# EAGLE design zero_board (EAGLE 9.6.2)
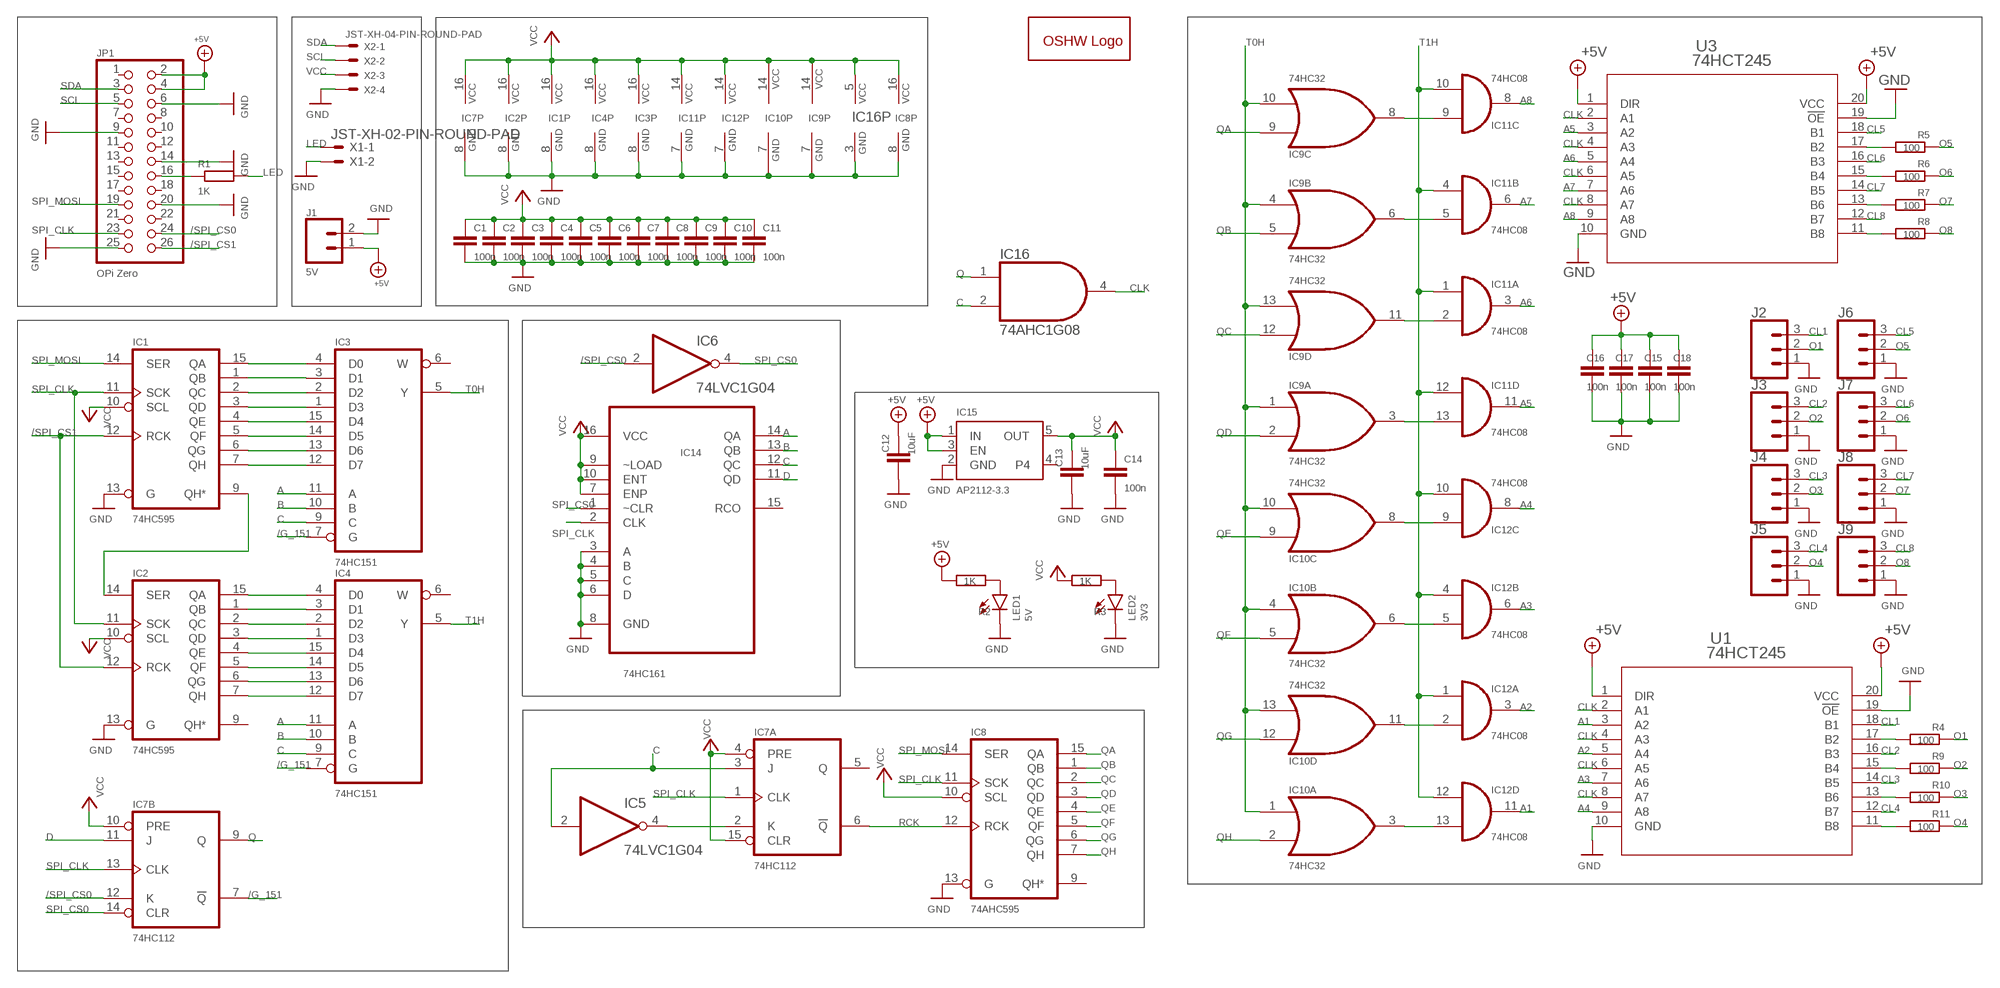
[diagram p0: schematic, sheet 1]

## Parts
C1  100n  C-EUC0603  [C0603]
C2  100n  C-EUC0603  [C0603]
C3  100n  C-EUC0603  [C0603]
C4  100n  C-EUC0603  [C0603]
C5  100n  C-EUC0603  [C0603]
C6  100n  C-EUC0603  [C0603]
C7  100n  C-EUC0603  [C0603]
C8  100n  C-EUC0603  [C0603]
C9  100n  C-EUC0603  [C0603]
C10  100n  C-EUC0603  [C0603]
C11  100n  C-EUC0603  [C0603]
C12  10uF  C-EUC0805  [C0805]
C13  10uF  C-EUC0805  [C0805]
C14  100n  C-EUC0603  [C0603]
C15  100n  C-EUC0603  [C0603]
C16  100n  C-EUC0603  [C0603]
C17  100n  C-EUC0603  [C0603]
C18  100n  C-EUC0603  [C0603]
GOLD_ORB_SM1  OSHWLOGOLOGO5MM  [OSHW_5MM]
IC1  74HC595  74HC595D  [SO16]
IC2  74HC595  74HC595D  [SO16]
IC3  74HC151  74HC151D  [SO16]
IC4  74HC151  74HC151D  [SO16]
IC5  74LVC1G04  74LVC1G04DCK  [SC70-5]
IC6  74LVC1G04  74LVC1G04DCK  [SC70-5]
IC7  74HC112  74HC112D  [SO16]
IC8  74AHC595  74HC595D  [SO16]
IC9  74HC32  74LS32D  [SO14]
IC10  74HC32  74LS32D  [SO14]
IC11  74HC08  74HC08D  [SO14]
IC12  74HC08  74HC08D  [SO14]
IC14  74HC161  SN74HC161DR  [SOIC127P600X175-16N]
IC15  AP2112-3.3  VREG_SOT23-5  [SOT23-5]
IC16  74AHC1G08  74AHC1G08DCK  [SC70-5]
J1  5V  CONN_023.5MM  [SCREWTERMINAL-3.5MM-2]
J2  CONN_03SCREW-NS  [SCREWTERMINAL-3.5MM-3-NS]
J3  CONN_03SCREW-NS  [SCREWTERMINAL-3.5MM-3-NS]
J4  CONN_03SCREW-NS  [SCREWTERMINAL-3.5MM-3-NS]
J5  CONN_03SCREW-NS  [SCREWTERMINAL-3.5MM-3-NS]
J6  CONN_03SCREW-NS  [SCREWTERMINAL-3.5MM-3-NS]
J7  CONN_03SCREW-NS  [SCREWTERMINAL-3.5MM-3-NS]
J8  CONN_03SCREW-NS  [SCREWTERMINAL-3.5MM-3-NS]
J9  CONN_03SCREW-NS  [SCREWTERMINAL-3.5MM-3-NS]
JP1  OPi Zero  PINHD-2X13  [2X13]
LED1  5V  LEDCHIP-LED0603  [CHIP-LED0603]
LED2  3V3  LEDCHIP-LED0603  [CHIP-LED0603]
R1  1K  R-EU_R0603  [R0603]
R2  1K  R-EU_R0603  [R0603]
R3  1K  R-EU_R0603  [R0603]
R4  100  R-EU_R0603  [R0603]
R5  100  R-EU_R0603  [R0603]
R6  100  R-EU_R0603  [R0603]
R7  100  R-EU_R0603  [R0603]
R8  100  R-EU_R0603  [R0603]
R9  100  R-EU_R0603  [R0603]
R10  100  R-EU_R0603  [R0603]
R11  100  R-EU_R0603  [R0603]
U1  74HCT245  SN74HCT245PWR  [PW20]
U3  74HCT245  SN74HCT245PWR  [PW20]
X1  JST-XH-02-PIN-ROUND-PAD  [JST-XH-02-PACKAGE-ROUND-PAD]
X2  JST-XH-04-PIN-ROUND-PAD  [JST-XH-04-PACKAGE-ROUND-PAD]

## Nets
+5V: C12.1 C15.1 C16.1 C17.1 C18.1 IC15.1(IN) IC15.3(EN) J1.1 JP1.2 JP1.4 R2.1 U1.1(DIR) U1.20(VCC) U3.1(DIR) U3.20(VCC)
/G_151: IC3.7(G) IC4.7(G) IC7.7(B:!Q)
/SPI_CS0: IC6.2(I) IC7.12(B:K) JP1.24
/SPI_CS1: IC1.12(RCK) IC2.12(RCK) JP1.26
A: IC3.11(A) IC4.11(A) IC14.14(QA)
A1: IC12.11(D:O) U1.3(A2)
A2: IC12.3(A:O) U1.5(A4)
A3: IC12.6(B:O) U1.7(A6)
A4: IC12.8(C:O) U1.9(A8)
A5: IC11.11(D:O) U3.3(A2)
A6: IC11.3(A:O) U3.5(A4)
A7: IC11.6(B:O) U3.7(A6)
A8: IC11.8(C:O) U3.9(A8)
B: IC3.10(B) IC4.10(B) IC14.13(QB)
C: IC3.9(C) IC4.9(C) IC5.2(I) IC7.3(A:J) IC14.12(QC) IC16.2(I1)
CL1: J2.3 U1.18(B1)
CL2: J3.3 U1.16(B3)
CL3: J4.3 U1.14(B5)
CL4: J5.3 U1.12(B7)
CL5: J6.3 U3.18(B1)
CL6: J7.3 U3.16(B3)
CL7: J8.3 U3.14(B5)
CL8: J9.3 U3.12(B7)
CLK: IC16.4(O) U1.2(A1) U1.4(A3) U1.6(A5) U1.8(A7) U3.2(A1) U3.4(A3) U3.6(A5) U3.8(A7)
D: IC7.11(B:J) IC14.11(QD)
GND: C1.2 C2.2 C3.2 C4.2 C5.2 C6.2 C7.2 C8.2 C9.2 C10.2 C11.2 C12.2 C13.2 C14.2 C15.2 C16.2 C17.2 C18.2 IC1.8(GND) IC1.13(G) IC2.8(GND) IC2.13(G) IC3.8(GND) IC4.8(GND) IC7.8(P:GND) IC8.8(GND) IC8.13(G) IC9.7(P:GND) IC10.7(P:GND) IC11.7(P:GND) IC12.7(P:GND) IC14.3(A) IC14.4(B) IC14.5(C) IC14.6(D) IC14.8(GND) IC15.2(GND) IC16.3(GND) J1.2 J2.1 J3.1 J4.1 J5.1 J6.1 J7.1 J8.1 J9.1 JP1.6 JP1.9 JP1.14 JP1.20 JP1.25 LED1.C LED2.C U1.10(GND) U1.19(!OE) U3.10(GND) U3.19(!OE) X1.2 X2.4
LED: R1.2 X1.1
N$1: IC10.11(D:O) IC12.2(A:I1)
N$2: IC10.6(B:O) IC12.5(B:I1)
N$3: IC10.8(C:O) IC12.9(C:I0)
N$4: IC10.3(A:O) IC12.13(D:I1)
N$5: IC9.8(C:O) IC11.9(C:I0)
N$6: IC9.6(B:O) IC11.5(B:I1)
N$7: IC9.11(D:O) IC11.2(A:I1)
N$8: JP1.16 R1.1
N$9: R11.1 U1.11(B8)
N$10: R8.1 U3.11(B8)
N$11: IC1.15(QA) IC3.4(D0)
N$12: IC1.1(QB) IC3.3(D1)
N$13: IC1.2(QC) IC3.2(D2)
N$14: IC1.3(QD) IC3.1(D3)
N$15: IC5.4(O) IC7.2(A:K)
N$16: IC9.3(A:O) IC11.13(D:I1)
N$17: R7.1 U3.13(B6)
N$19: IC2.15(QA) IC4.4(D0)
N$20: R10.1 U1.13(B6)
N$21: IC1.4(QE) IC3.15(D4)
N$22: IC1.5(QF) IC3.14(D5)
N$23: IC1.6(QG) IC3.13(D6)
N$24: IC1.7(QH) IC3.12(D7)
N$25: IC2.1(QB) IC4.3(D1)
N$26: R6.1 U3.15(B4)
N$27: IC2.2(QC) IC4.2(D2)
N$28: IC2.3(QD) IC4.1(D3)
N$29: IC2.4(QE) IC4.15(D4)
N$30: IC2.5(QF) IC4.14(D5)
N$31: IC2.6(QG) IC4.13(D6)
N$32: IC2.7(QH) IC4.12(D7)
N$34: R5.1 U3.17(B2)
N$35: LED1.A R2.2
N$36: LED2.A R3.2
N$37: R9.1 U1.15(B4)
N$39: R4.1 U1.17(B2)
N$44: IC1.9(QH*) IC2.14(SER)
O1: J2.2 R4.2
O2: J3.2 R9.2
O3: J4.2 R10.2
O4: J5.2 R11.2
O5: J6.2 R5.2
O6: J7.2 R6.2
O7: J8.2 R7.2
O8: J9.2 R8.2
Q: IC7.9(B:Q) IC16.1(I0)
QA: IC8.15(QA) IC9.9(C:I0)
QB: IC8.1(QB) IC9.5(B:I1)
QC: IC8.2(QC) IC9.12(D:I0)
QD: IC8.3(QD) IC9.2(A:I1)
QE: IC8.4(QE) IC10.9(C:I0)
QF: IC8.5(QF) IC10.5(B:I1)
QG: IC8.6(QG) IC10.12(D:I0)
QH: IC8.7(QH) IC10.2(A:I1)
RCK: IC7.6(A:!Q) IC8.12(RCK)
SCL: JP1.5 X2.2
SDA: JP1.3 X2.1
SPI_CLK: IC1.11(SCK) IC2.11(SCK) IC7.1(A:CLK) IC7.13(B:CLK) IC8.11(SCK) IC14.2(CLK) JP1.23
SPI_CS0: IC6.4(O) IC7.14(B:CLR) IC14.1(~CLR)
SPI_MOSI: IC1.14(SER) IC8.14(SER) JP1.19
T0H: IC3.5(Y) IC9.1(A:I0) IC9.4(B:I0) IC9.10(C:I1) IC9.13(D:I1) IC10.1(A:I0) IC10.4(B:I0) IC10.10(C:I1) IC10.13(D:I1)
T1H: IC4.5(Y) IC11.1(A:I0) IC11.4(B:I0) IC11.10(C:I1) IC11.12(D:I0) IC12.1(A:I0) IC12.4(B:I0) IC12.10(C:I1) IC12.12(D:I0)
VCC: C1.1 C2.1 C3.1 C4.1 C5.1 C6.1 C7.1 C8.1 C9.1 C10.1 C11.1 C13.1 C14.1 IC1.10(SCL) IC1.16(VCC) IC2.10(SCL) IC2.16(VCC) IC3.16(VCC) IC4.16(VCC) IC7.4(A:PRE) IC7.10(B:PRE) IC7.15(A:CLR) IC7.16(P:VCC) IC8.10(SCL) IC8.16(VCC) IC9.14(P:VCC) IC10.14(P:VCC) IC11.14(P:VCC) IC12.14(P:VCC) IC14.7(ENP) IC14.9(~LOAD) IC14.10(ENT) IC14.16(VCC) IC15.5(OUT) IC16.5(VCC) R3.1 X2.3
Unconnected: IC2.9(QH*) IC3.6(W) IC4.6(W) IC7.5(A:Q) IC8.9(QH*) IC14.15(RCO) IC15.4 JP1.1 JP1.7 JP1.8 JP1.10 JP1.11 JP1.12 JP1.13 JP1.15 JP1.17 JP1.18 JP1.21 JP1.22

## Power pins joined to a net without a drawn wire
GND: IC5.3(GND) IC6.3(GND)
VCC: IC5.5(VCC) IC6.5(VCC)

## Library data of the parts
C1-C18 = rcl:C-EU: CAPACITOR, European symbol; SPICEPREFIX: C
GOLD_ORB_SM1 = oshw:OSHWLOGO: The OSHW logo for PCB layout
IC1 IC2 IC8 = 74xx-eu:74*595: 8-bit SHIFT REGISTER, output latch
IC3 IC4 = 74xx-eu:74*151: Data SELECTOR/MULTIPLEXER
IC5 IC6 = 74xx-little-us:74*1G04: INVERTER Gate
IC7 = 74xx-eu:74*112: Dual J-K negative edge triggered FLIP FLOP, preset and clear
IC9 IC10 = 74xx-us:74*32: Quad 2-input OR gate
IC11 IC12 = 74xx-eu:74*08: Quad 2-input AND gate
IC14 = SN74HC161DR:SN74HC161DR: 4-Bit Synchronus Binary Counters; AVAILABILITY: Unavailable; DESCRIPTION: 4-Bit Synchronous Binary Counters 16-SOIC -40 to 85; MF: Texas Instruments; MP: SN74HC161DR; PACKAGE: SOIC-16 Texas Instruments; PRICE: None
IC15 = microbuilder:VREG_SOT23-5: SOT23-5 Fixed Voltage Regulators Part Current Out V Out V In V Dropout θJA (°C/W) TJ (°C) Digikey Part No. ADP121 150mA 3.3V 3.4-5.5V 0.09V @ 150mA -- -- ADP121-AUJZ33R7CT-ND ADP121 150mA 3.0V 3.1-5.5V 0.09V @ 150mA -- -- ADP121-AUJZ30R7CT-ND ADP122 300mA 3.3V 3.4-5.5V 0.085V @ 300mA -- -- ADP122AUJZ-3.3-R7CT-ND ADP1712 300mA 3.3V 3.5-5.5V 0.17V @ 300mA -- -- ADP1712AUJZ-3.3-R7TR-ND AP7311 (Low Cost) 150mA 3.3V 3.5-6V 0.15V @ 150mA -- -- AP7311-33WG-7DICT-ND LD39015M18R 150mA 1.8V 1.9V-5.5V 0.08V @ 100mA -- -- 497-6977-1-ND LP2985A-33DBVR 150mA 3.3V 3.3-16V 0.28V @ 150mA 206 150 296-18479-1-ND MCP1824T-3302E/OT 300mA 3.3V 3.5V-6V 0.2V @ 300mA -- -- MCP1824T-3302E/OTCT-ND MIC5205-2.5YM5 TR 150mA 2.5V 2.7-16V 0.165V @ 150mA -- -- 576-1257-2-ND MIC5205-3.0YM5 TR 150mA 3.0V 3.2V-16V 0.165V @ 150mA -- -- 576-1258-2-ND MIC5205-3.3YM5 TR 150mA 3.3V 3.5V-16V 0.165V @ 150mA -- -- 576-1259-2-ND TPS780330220 150mA 3.3V+2.2V 3.6-5.5V 250mV Max -- -- 296-23332-1-ND TDA3663/N1,135 100mA 3.3V 3.5-45V 0.18V @ 50mA -- -- 568-5343-1-ND Max operating temp can be calculated using θJA, TJ (max junction temperature), and power in watts. Set the "Maximum Ambient Temperature" until it reaches TJ ("Max Junction Temperature"), which is the absolute limit for safe use of the regulator: Heat Sink Temperature Calculator <http://www.daycounter.com/Calculators/Heat-Sink-Temperature-Calculator.phtml> For example, With 12V source into a 3.3V LP2985 and a 30mA load, we are dissipating (12V-3.3V) * 0.03A = 0.261W. With a θJA of 206 °C/W, a TJ of 150°C, and 261mW we can safely use the chip without a heat sink up to 75°C (=147.1°C Junction Temperature).
IC16 = 74xx-little-us:74*1G08: 2-input AND gate
J1 = SparkFun-Connectors:CONN_02: Multi connection point. Often used as Generic Header-pin footprint for 0.1 inch spaced/style header connections On any of the 0.1 inch spaced packages, you can populate with these: Break Away Headers - Straight <https://www.sparkfun.com/products/116> (PRT-00116) Break Away Male Headers - Right Angle <https://www.sparkfun.com/products/553> (PRT-00553) Female Headers <https://www.sparkfun.com/products/115> (PRT-00115) Break Away Headers - Machine Pin <https://www.sparkfun.com/products/117> (PRT-00117) Break Away Female Headers - Swiss Machine Pin <https://www.sparkfun.com/products/743> (PRT-00743) For SCREWTERMINALS and SPRING TERMINALS visit here: Screw Terimnals on SparkFun.com <https://www.sparkfun.com/search/results?term=Screw+Terminals> (5mm/3.5mm/2.54mm spacing) This device is also useful as a general connection point to wire up your design to another part of your project. Our various solder wires solder well into these plated through hole pads. Hook-Up Wire - Assortment (Stranded, 22 AWG) <https://www.sparkfun.com/products/11375> (PRT-11375) Hook-Up Wire - Assortment (Solid Core, 22 AWG) <https://www.sparkfun.com/products/11367> (PRT-11367) View the entire wire category on our website here <https://www.sparkfun.com/categories/141> Special notes: Molex polarized connector foot print use with: PRT-08233 with associated crimp pins and housings. 2.54_SCREWTERM for use with PRT-10571. 3.5mm Screw Terminal footprints for PRT-08084 5mm Screw Terminal footprints for use with PRT-08432; PROD_ID: CONN-08399
J2-J9 = SparkFun-Connectors:CONN_03: Multi connection point. Often used as Generic Header-pin footprint for 0.1 inch spaced/style header connections On any of the 0.1 inch spaced packages, you can populate with these: Break Away Headers - Straight <https://www.sparkfun.com/products/116> (PRT-00116) Break Away Male Headers - Right Angle <https://www.sparkfun.com/products/553> (PRT-00553) Female Headers <https://www.sparkfun.com/products/115> (PRT-00115) Break Away Headers - Machine Pin <https://www.sparkfun.com/products/117> (PRT-00117) Break Away Female Headers - Swiss Machine Pin <https://www.sparkfun.com/products/743> (PRT-00743) Stackable Header - 3 Pin (Female, 0.1") <https://www.sparkfun.com/products/13875> (PRT-13875) For SCREWTERMINALS and SPRING TERMINALS visit here: Screw Terimnals on SparkFun.com <https://www.sparkfun.com/search/results?term=Screw+Terminals> (5mm/3.5mm/2.54mm spacing) This device is also useful as a general connection point to wire up your design to another part of your project. Our various solder wires solder well into these plated through hole pads. Hook-Up Wire - Assortment (Stranded, 22 AWG) <https://www.sparkfun.com/products/11375> (PRT-11375) Hook-Up Wire - Assortment (Solid Core, 22 AWG) <https://www.sparkfun.com/products/11367> (PRT-11367) View the entire wire category on our website here <https://www.sparkfun.com/categories/141> Special notes: Molex polarized connector foot print use with SKU : PRT-08232 with associated crimp pins and housings.
JP1 = pinhead:PINHD-2X13: PIN HEADER
LED1 LED2 = led:LED: LED OSRAM: - CHIPLED LG R971, LG N971, LY N971, LG Q971, LY Q971, LO R971, LY R971 LH N974, LH R974 LS Q976, LO Q976, LY Q976 LO Q996 - Hyper CHIPLED LW Q18S LB Q993, LB Q99A, LB R99A - SideLED LS A670, LO A670, LY A670, LG A670, LP A670 LB A673, LV A673, LT A673, LW A673 LH A674 LY A675 LS A676, LA A676, LO A676, LY A676, LW A676 LS A679, LY A679, LG A679 - Hyper Micro SIDELED® LS Y876, LA Y876, LO Y876, LY Y876 LT Y87S - SmartLED LW L88C, LW L88S LB L89C, LB L89S, LG L890 LS L89K, LO L89K, LY L89K LS L896, LA L896, LO L896, LY L896 - TOPLED LS T670, LO T670, LY T670, LG T670, LP T670 LSG T670, LSP T670, LSY T670, LOP T670, LYG T670 LG T671, LOG T671, LSG T671 LB T673, LV T673, LT T673, LW T673 LH T674 LS T676, LA T676, LO T676, LY T676, LB T676, LH T676, LSB T676, LW T676 LB T67C, LV T67C, LT T67C, LS T67K, LO T67K, LY T67K, LW E67C LS E67B, LA E67B, LO E67B, LY E67B, LB E67C, LV E67C, LT E67C LW T67C LS T679, LY T679, LG T679 LS T770, LO T770, LY T770, LG T770, LP T770 LB T773, LV T773, LT T773, LW T773 LH T774 LS E675, LA E675, LY E675, LS T675 LS T776, LA T776, LO T776, LY T776, LB T776 LHGB T686 LT T68C, LB T68C - Hyper Mini TOPLED® LB M676 - Mini TOPLED Santana® LG M470 LS M47K, LO M47K, LY M47K Source: http://www.osram.convergy.de LUXEON: - LUMILED® LXK2-PW12-R00, LXK2-PW12-S00, LXK2-PW14-U00, LXK2-PW14-V00 LXK2-PM12-R00, LXK2-PM12-S00, LXK2-PM14-U00 LXK2-PE12-Q00, LXK2-PE12-R00, LXK2-PE12-S00, LXK2-PE14-T00, LXK2-PE14-U00 LXK2-PB12-K00, LXK2-PB12-L00, LXK2-PB12-M00, LXK2-PB14-N00, LXK2-PB14-P00, LXK2-PB14-Q00 LXK2-PR12-L00, LXK2-PR12-M00, LXK2-PR14-Q00, LXK2-PR14-R00 LXK2-PD12-Q00, LXK2-PD12-R00, LXK2-PD12-S00 LXK2-PH12-R00, LXK2-PH12-S00 LXK2-PL12-P00, LXK2-PL12-Q00, LXK2-PL12-R00 Source: www.luxeon.com KINGBRIGHT: KA-3528ASYC Source: www.kingbright.com
R1-R11 = rcl:R-EU_: RESISTOR, European symbol
U1 U3 = SN74HCT245PWR:SN74HCT245PWR; DATASHEET_URL: http://www.ti.com/lit/gpn/SN74HCT245; DESCRIPTION: Octal Bus Transceivers With 3-State Outputs; FAMILY_NAME: STANDARD TRANSCEIVER; GENERIC_PART_NUMBER: SN74HCT245; INDUSTRY_STD_PKG_TYPE: TSSOP; MANUFACTURER: Texas Instruments; MANUFACTURER_PART_NUMBER: SN74HCT245PWR; PACKAGE_DESIGNATOR: PW; PIN_COUNT: 20; VENDOR: Texas Instruments
X1 = Rembrandt Electronics - JST XH Connectors v1-0:JST-XH-02-PIN: JST XH Connector 2 Pin Wire to board connector. Pitch: 2,54 mm, (0.100") Number of pins: 2 Created by Rembrandt Electronics www.rembrandtelectronics.com
X2 = Rembrandt Electronics - JST XH Connectors v1-0:JST-XH-04-PIN: JST XH Connector 2 Pin Wire to board connector. Pitch: 2,54 mm, (0.100") Number of pins: 4 Created by Rembrandt Electronics www.rembrandtelectronics.com

## Net classes
0 default: clearance 0.205 mm

## Board
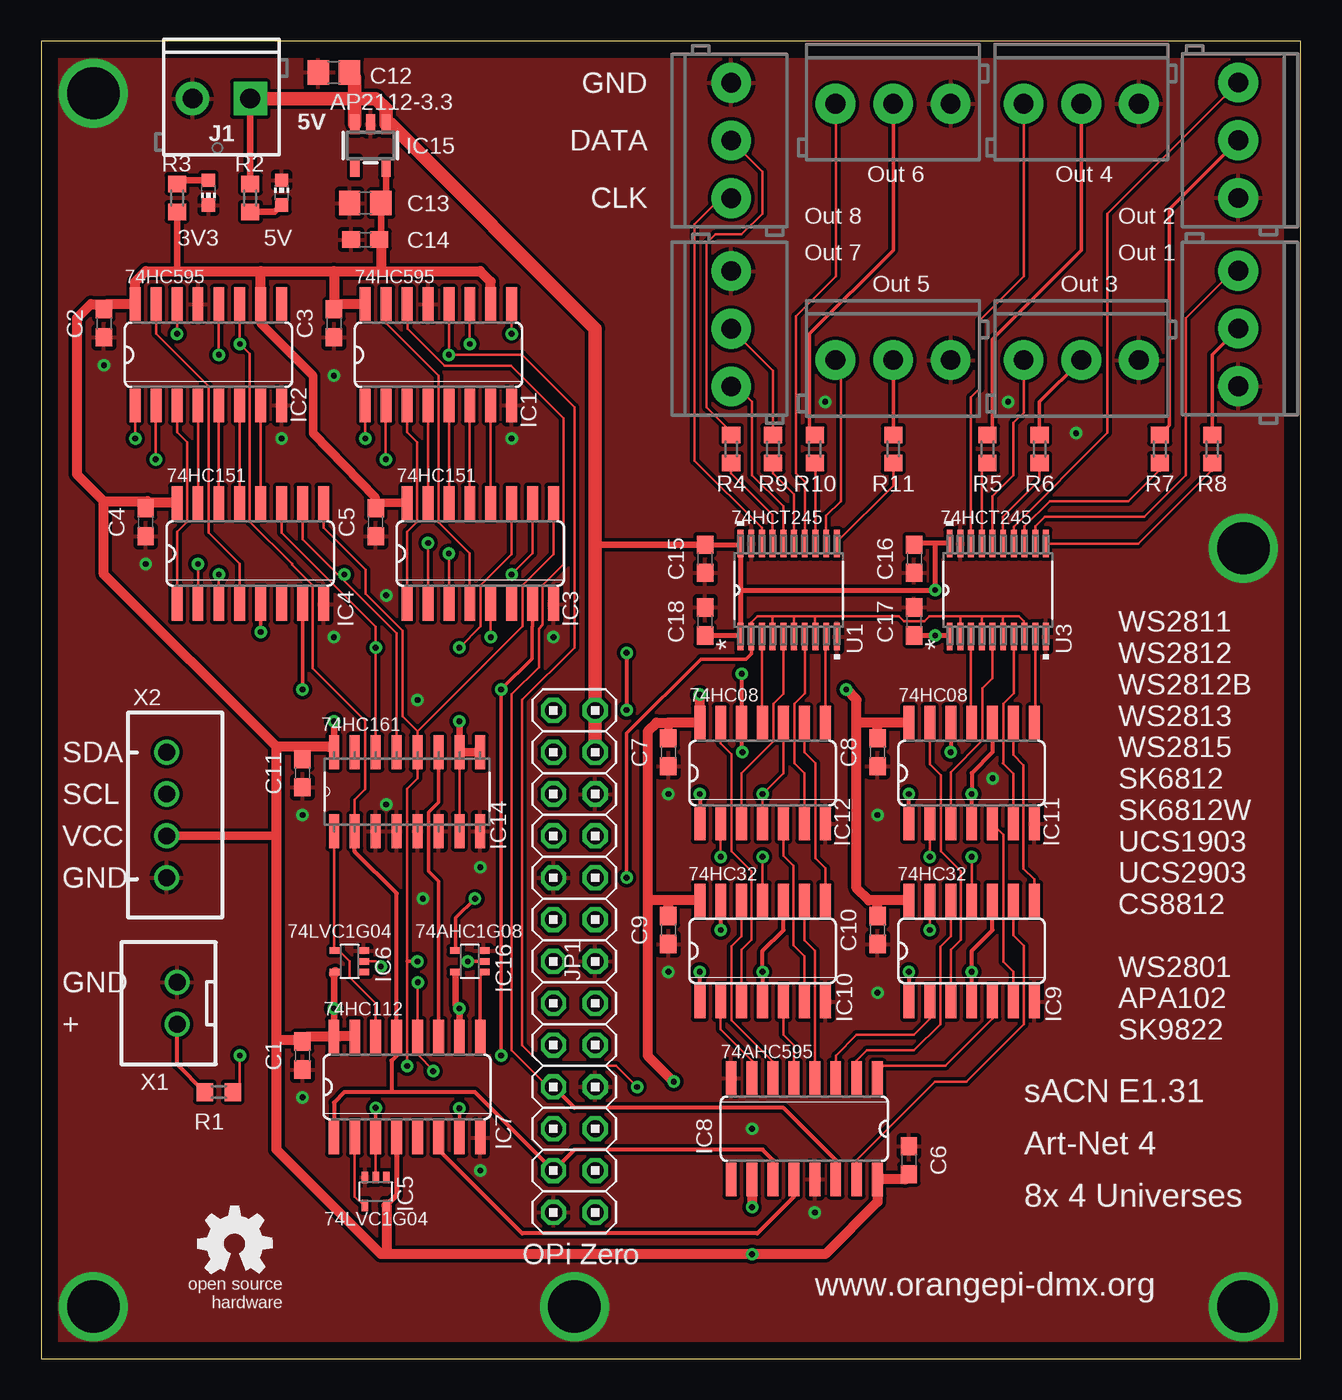
[diagram p1: board, top side]
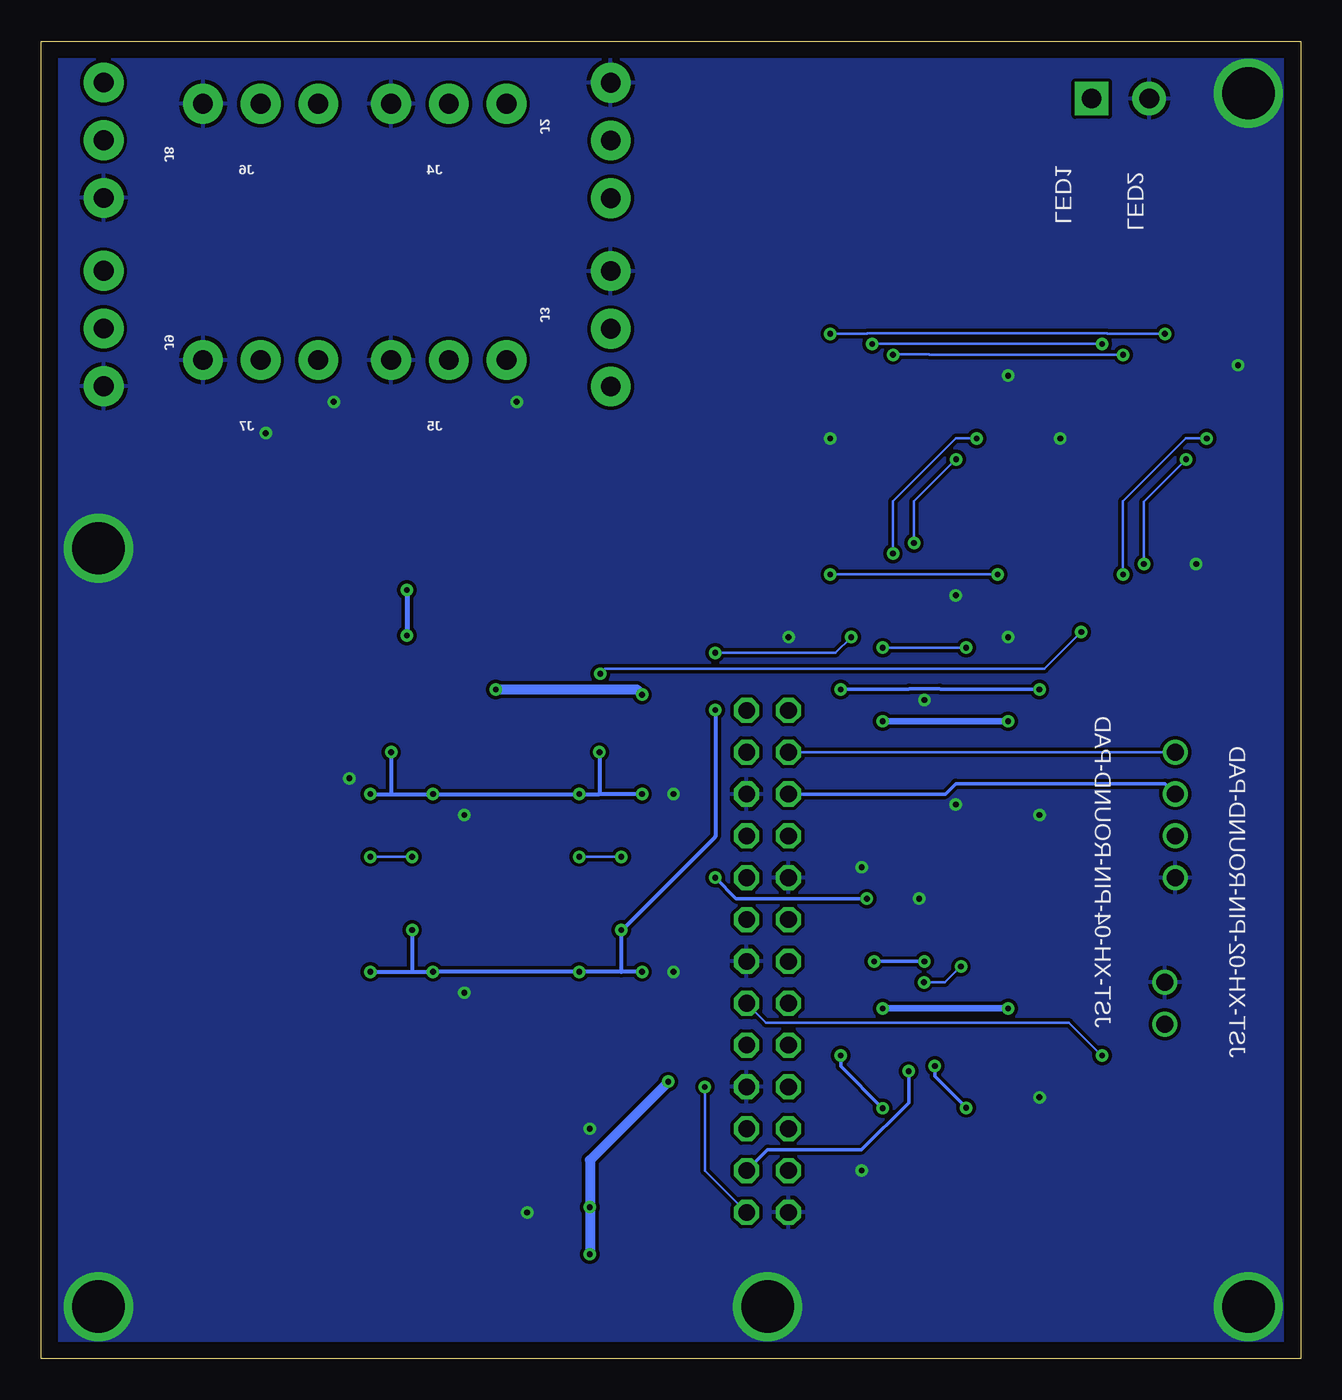
[diagram p2: board, bottom side, seen from below]

Size 76.51 x 80 mm. Coordinates in mm from the lower left corner, seen from the top.
Outline: 0,0 76.51,0 76.51,80 0,80 0,0
Copper layers (1*16): Top 0.035mm / dielectric 1.5mm / Bottom 0.035mm
Design rules "default": minimum track width 6mil, minimum drill 0.35mm, track to track 6mil, track to pad 6mil, pad to pad 6mil, via to via 6mil, smd to smd 6mil, copper to edge 40mil, drill to drill 6mil, minimum pad ring 10mil, minimum via ring 8mil, stop-mask expansion 4mil, vias tented up to drill 0mil, thermal gap 10mil

### Footprints (pad centres in the part's own frame; a part is rotated, then mirrored left to right if it is on the bottom)
C0603 = smd 1.1 x 1: 1 -0.85,0; 2 0.85,0
C0805 = smd 1.3 x 1.5: 1 -0.95,0; 2 0.95,0
SO16 = smd 0.66 x 2.032: 1 -4.445,-3.073; 2 -3.175,-3.073; 3 -1.905,-3.073; 4 -0.635,-3.073; 5 0.635,-3.073; 6 1.905,-3.073; 7 3.175,-3.073; 8 4.445,-3.073; 9 4.445,3.073; 10 3.175,3.073; 11 1.905,3.073; 12 0.635,3.073; 13 -0.635,3.073; 14 -1.905,3.073; 15 -3.175,3.073; 16 -4.445,3.073
SC70-5 = smd 0.4 x 0.7: 1 -0.65,-0.85; 2 0,-0.85; 3 0.65,-0.85; 4 0.65,0.85; 5 -0.65,0.85
SO14 = smd 0.66 x 2.032: 1 -3.81,-3.073; 2 -2.54,-3.073; 3 -1.27,-3.073; 4 0,-3.073; 5 1.27,-3.073; 6 2.54,-3.073; 7 3.81,-3.073; 8 3.81,3.073; 9 2.54,3.073; 10 1.27,3.073; 11 0,3.073; 12 -1.27,3.073; 13 -2.54,3.073; 14 -3.81,3.073
SOIC127P600X175-16N = smd 2.057 x 0.61: 1 -4.801,8.89; 2 -4.801,7.62; 3 -4.801,6.35; 4 -4.801,5.08; 5 -4.801,3.81; 6 -4.801,2.54; 7 -4.801,1.27; 8 -4.801,0; 9 0,0; 10 0,1.27; 11 0,2.54; 12 0,3.81; 13 0,5.08; 14 0,6.35; 15 0,7.62; 16 0,8.89
SOT23-5 = smd 0.55 x 1.2: 1 -0.95,-1.3; 2 0,-1.3; 3 0.95,-1.3; 4 0.95,1.3; 5 -0.95,1.3
SCREWTERMINAL-3.5MM-2 = drill 1.2 pad 2.032 square: 1 0,0 | drill 1.2 pad 2.032: 2 3.5,0
SCREWTERMINAL-3.5MM-3-NS = drill 1.2 pad 2.413: 1 0,0; 2 3.5,0; 3 7,0
2X13 = drill 1.016 octagon: 1 -15.24,-1.27; 2 -15.24,1.27; 3 -12.7,-1.27; 4 -12.7,1.27; 5 -10.16,-1.27; 6 -10.16,1.27; 7 -7.62,-1.27; 8 -7.62,1.27; 9 -5.08,-1.27; 10 -5.08,1.27; 11 -2.54,-1.27; 12 -2.54,1.27; 13 0,-1.27; 14 0,1.27; 15 2.54,-1.27; 16 2.54,1.27; 17 5.08,-1.27; 18 5.08,1.27; 19 7.62,-1.27; 20 7.62,1.27; 21 10.16,-1.27; 22 10.16,1.27; 23 12.7,-1.27; 24 12.7,1.27; 25 15.24,-1.27; 26 15.24,1.27
CHIP-LED0603 = smd 0.8 x 0.8: A 0,-0.75; C 0,0.75
R0603 = smd 1 x 1.1: 1 -0.85,0; 2 0.85,0
PW20 = smd 1.676 x 0.356: 1 -2.819,2.925; 2 -2.819,2.275; 3 -2.819,1.625; 4 -2.819,0.975; 5 -2.819,0.325; 6 -2.819,-0.325; 7 -2.819,-0.975; 8 -2.819,-1.625; 9 -2.819,-2.275; 10 -2.819,-2.925; 11 2.819,-2.925; 12 2.819,-2.275; 13 2.819,-1.625; 14 2.819,-0.975; 15 2.819,-0.325; 16 2.819,0.325; 17 2.819,0.975; 18 2.819,1.625; 19 2.819,2.275; 20 2.819,2.925
JST-XH-02-PACKAGE-ROUND-PAD = drill 1.016: 1 -1.27,0; 2 1.27,0
JST-XH-04-PACKAGE-ROUND-PAD = drill 1.016: 1 -3.81,0; 2 -1.27,0; 3 1.27,0; 4 3.81,0

### Placement (x,y rotation side)
C1  15.88,18.41 270 top
C2  3.81,62.87 270 top
C3  17.78,62.87 270 top
C4  6.35,50.8 270 top
C5  20.32,50.8 270 top
C6  52.7,12.06 90 top
C7  38.1,36.83 270 top
C8  50.8,36.83 270 top
C9  38.1,26.04 270 top
C10  50.8,26.04 270 top
C11  15.88,35.56 270 top
C12  17.78,78.11 180 top
C13  19.69,70.17 180 top
C14  19.69,67.94 180 top
C15  40.32,48.58 270 top
C16  53.02,48.58 270 top
C17  53.02,44.77 90 top
C18  40.32,44.77 90 top
GOLD_ORB_SM1  11.75,6.99 0 top
IC1  24.13,60.96 0 top
IC2  10.16,60.96 0 top
IC3  26.67,48.9 0 top
IC4  12.7,48.9 0 top
IC5  20.32,10.16 180 top
IC6  18.73,24.13 90 top
IC7  22.23,16.51 0 top
IC8  46.35,13.97 180 top
IC9  56.52,24.77 0 top
IC10  43.81,24.77 0 top
IC11  56.52,35.56 0 top
IC12  43.81,35.56 0 top
IC14  26.67,36.83 90 top
IC15  20,73.66 180 top
IC16  26.04,24.13 90 top
J1  12.7,76.52 180 top
J2  41.91,77.47 270 top
J3  41.91,66.04 270 top
J4  55.24,76.2 180 top
J5  55.24,60.64 180 top
J6  66.68,76.2 180 top
J7  66.68,60.64 180 top
J8  72.71,70.48 90 top
J9  72.71,59.05 90 top
JP1  32.38,24.13 270 top
LED1  14.61,70.8 0 top
LED2  10.16,70.8 180 top
R1  10.79,16.19 180 top
R2  12.7,70.48 270 top
R3  8.26,70.48 90 top
R4  41.91,55.24 90 top
R5  57.47,55.24 90 top
R6  60.64,55.24 90 top
R7  67.95,55.24 90 top
R8  71.12,55.24 90 top
R9  44.45,55.24 90 top
R10  46.99,55.24 90 top
R11  51.75,55.24 90 top
U1  45.4,46.67 90 top
U3  58.1,46.67 90 top
X1  8.26,21.59 90 top
X2  7.62,33.02 270 top

### Tracks (layer width: path | path; a pad name or v marks a point on that pad's centre or on a via)
+5V  (via drill 0.35)
  Top 0.152: 42.41,49.43 U1.20
  Top 0.305: C18.1 42.41,43.92 | 42.41,43.92 U1.1 | C15.1 42.41,49.43 | U1.20 42.48,46.67 | 42.48,46.67 42.48,43.98 42.41,43.92 | 42.48,46.67 v54.29,46.67 54.29,49.53 | 54.29,49.53 55.14,49.53 U3.20 | C17.1 v54.29,43.92 55.11,43.92 U3.1 | C16.1 53.12,49.53 54.29,49.53
  Top 0.406: IC15.3 | 19.05,77.79 C12.1 | J1.1 R2.1 | C15.1 33.87,49.43 33.66,49.21
  Top 0.61: 21.24,74.96 IC15.1
  Top 0.813: JP1.4 JP1.2 33.66,49.21 33.66,62.55 21.24,74.96 | IC15.3 19.05,76.52 | 19.05,76.52 19.05,77.79 | J1.1 19.05,76.52 | IC15.1 20.95,75.89 20.32,76.52 19.05,76.52
  Bottom 0.305: v54.29,46.67 v54.29,43.92
/G_151  (via drill 0.35)
  Top 0.203: v15.88,40.64 IC4.7 | IC3.7 29.85,44.49 29.82,44.46 29.82,42.52 v27.94,40.64 v27.94,18.41 | IC7.7 v25.4,15.21
  Bottom 0.203: v27.94,40.64 23.83,40.64 23.78,40.69 21.94,40.69 21.89,40.64 v15.88,40.64 | v25.4,15.21 27.94,17.75 v27.94,18.41
/SPI_CS0  (via drill 0.35)
  Top 0.152: IC6.2 20.32,24.13 v20.64,23.81 | v22.88,22.86 22.86,22.84 IC7.12 22.88,19.56 22.88,18.45 23.81,17.52 v23.81,17.46
  Bottom 0.152: v20.64,23.81 20.66,23.81 21.61,22.86 v22.88,22.86
  Bottom 0.203: JP1.24 32.38,12.7 26.67,12.7 23.81,15.56 v23.81,17.46
/SPI_CS1  (via drill 0.35)
  Top 0.152: IC1.12 v24.77,60.96 29.21,60.96 32.38,57.78 32.38,43.18 29.21,40.01 29.21,19.05 30.48,17.78 34.92,17.78 v36.2,16.51 | IC2.12 v10.79,60.96
  Bottom 0.152: JP1.26 36.2,11.43 v36.2,16.51 | v10.79,60.96 22.56,60.96 22.59,60.98 24.77,60.98 v24.77,60.96
A  (via drill 0.35)
  Top 0.152: v25.4,43.18 26.69,44.47 26.69,46.95 28.58,48.84 IC3.11 | IC14.14 v20.32,43.18 20.32,44.45 14.61,50.16 IC4.11
  Bottom 0.152: v25.4,43.18 v20.32,43.18
A1
  Top 0.152: U1.3 43.78,38.67 IC12.11
A2
  Top 0.152: IC12.3 42.54,35.56 44.47,37.49 44.47,39.77 45.08,40.37 U1.5
A3
  Top 0.152: IC12.6 46.35,35.56 45.74,36.17 45.74,39.77 46.38,40.4 U1.7
A4
  Top 0.152: IC12.8 47.62,43.8 U1.9
A5
  Top 0.152: U3.3 56.48,38.67
  Top 0.254: 56.48,38.67 IC11.11
A6
  Top 0.152: IC11.3 55.24,35.62 57.17,37.55 57.17,40.72 57.78,41.32 U3.5
A7
  Top 0.152: IC11.6 59.05,35.52 58.42,36.16 58.44,36.18 58.44,39.77 59.08,40.4 U3.7
A8
  Top 0.152: U3.9 60.38,38.69
  Top 0.254: 60.38,38.69 IC11.8
B  (via drill 0.35)
  Top 0.152: IC3.10 29.85,48.9 v28.58,47.62 | IC14.13 21.59,44.05 18.02,47.62 | 18.02,47.62 15.88,49.77 IC4.10 | v18.42,47.62 18.02,47.62
  Bottom 0.152: v28.58,47.62 v18.42,47.62
C  (via drill 0.35)
  Top 0.152: IC3.9 31.12,48.84 29.23,46.95 29.23,44.47 22.86,38.1 | 22.86,38.1 IC14.12 22.86,35.24 22.23,34.61 22.23,24.13 v22.23,17.78 | 22.86,38.1 21.95,39.01 21.95,44.2 19.71,46.44 19.71,47.9 17.15,50.46 IC4.9 | IC7.3 IC5.2
  Top 0.203: IC7.3 v20.32,15.24 | IC16.2 v25.91,24.13 | v22.86,24.13 22.23,24.13
  Bottom 0.203: v20.32,15.24 22.23,17.14 v22.23,17.78 | v25.91,24.13 v22.86,24.13
CL1
  Top 0.152: J2.3 41.26,70.47 39.69,68.9 39.69,54.53 43.78,50.45 U1.18
CL2
  Top 0.152: U1.16 45.08,51.76 43.18,53.66 43.18,58.1 42.24,59.04 J3.3
CL3
  Top 0.152: J4.3 48.26,76.19 48.26,65.72 45.84,63.3 45.84,53.78 46.38,53.24 U1.14
CL4
  Top 0.152: U1.12 47.68,51.19 48.56,52.07 48.56,60.33 J5.3
CL5
  Top 0.152: U3.18 56.48,58.38 57.01,58.91 57.01,63.05 59.67,65.72 J6.3
CL6
  Top 0.152: J7.3 59.67,57.45 59.05,56.83 59.05,53.66 57.78,52.38 U3.16
CL7
  Top 0.152: J8.3 64.77,69.53 64.77,56.23 59.08,50.53 U3.14
  Top 0.254: J8.3
CL8
  Top 0.152: U3.12 60.38,50.53 60.96,51.12 66.99,51.12 69.53,53.66 69.53,63.18 72.41,66.06
  Top 0.254: J9.3 72.41,66.06
CLK  (via drill 0.35)
  Top 0.152: U3.8 59.69,43.89 59.69,44.77 59.37,45.09 58.42,45.09 | 58.42,45.09 57.15,45.09 | 57.15,45.09 55.88,45.09 | 55.88,45.09 53.94,45.09 53.64,44.79 52.41,44.79 52.11,45.09 46.99,45.09 | 46.99,45.09 45.72,45.09 | 45.72,45.09 44.45,45.09 | U3.6 58.42,45.09 | U3.4 57.13,45.06 57.15,45.09 | U3.2 55.83,45.03 55.88,45.09 | U1.8 46.99,43.89 46.99,45.09 | U1.6 45.72,45.09 | U1.4 44.43,45.06 44.45,45.09 | U1.2 43.13,44.72 43.5,45.09 44.45,45.09
  Top 0.203: IC16.4 25.19,26.77 v26.35,27.94 | v35.56,29.21 35.56,37.98 40.07,42.48 42.8,42.48 43.13,42.81 U1.2
  Bottom 0.203: v26.35,27.94 34.29,27.94 v35.56,29.21
D
  Top 0.203: IC7.11 24.13,28.99 23.52,29.6 23.52,33.19 24.13,33.8 IC14.11
GND  (via drill 0.35, 3.17)
  other vias: 15.88,33.02 3.17,3.17 73.03,3.17 73.03,49.21 3.17,76.83 38.1,23.5 38.1,34.29 50.8,33.02 50.8,22.23 43.18,13.97 32.38,3.17 15.88,15.88 57.78,35.24 3.81,60.33 6.35,48.26 28.58,55.88 31.12,43.81 17.78,43.81 22.86,40.01 14.61,55.88 17.78,59.69 20.96,46.35 23.18,27.94 20.96,33.66 46.99,8.89 26.67,11.43 26.67,29.84 62.86,56.2 58.74,58.1 47.62,58.1
  pour Top: 0,0 76.84,0 76.84,80.01 0,80.01
  pour Bottom: 0,0 76.84,0 76.84,80.01 0,80.01
LED
  Top 0.254: R1.2 8.26,17.88 X1.1
N$1  (via drill 0.35)
  Top 0.152: IC12.2 v41.27,30.48 | IC10.11 v43.81,30.48
  Bottom 0.152: v41.27,30.48 v43.81,30.48
N$2
  Top 0.152: IC12.5 45.09,30.54 45.7,29.92 45.7,25.11 46.35,24.45 IC10.6
N$3
  Top 0.152: IC10.8 47.62,29.79 47.01,30.4 47.01,36.17 46.35,36.83 IC12.9
N$4
  Top 0.152: IC12.13 41.27,37.36 41.93,36.7 41.93,30.83 43.16,29.61 43.16,25.44 42.54,24.82 IC10.3
N$5
  Top 0.152: IC9.8 60.32,29.11 59.67,29.77 59.67,36.05 59.05,36.66 IC11.9
N$6
  Top 0.152: IC11.5 58.44,31.83 58.44,24.11 59.05,23.5 IC9.6
N$7  (via drill 0.35)
  Top 0.152: IC11.2 v53.98,30.48 | IC9.11 v56.52,30.48
  Bottom 0.152: v53.98,30.48 v56.52,30.48
N$8  (via drill 0.35)
  Top 0.152: R1.1 12.06,16.61 v12.06,18.41
  Bottom 0.152: v12.06,18.41 12.08,18.41 14.08,20.41 32.48,20.41 JP1.16
N$9
  Top 0.152: R11.1 51.75,53.02 48.33,49.6 U1.11
N$10
  Top 0.152: U3.11 66.64,49.49 71.12,53.98
  Top 0.254: 71.12,53.98 R8.1
N$11
  Top 0.152: IC3.4 26.04,48.9 24.13,50.8 24.13,59.69 20.96,62.87 IC1.15
N$12  (via drill 0.35)
  Top 0.152: v19.69,55.88 IC1.1 | v24.77,48.9 IC3.3
  Bottom 0.152: v19.69,55.88 20.96,55.88 24.77,52.07 v24.77,48.9
N$13  (via drill 0.35)
  Top 0.152: v20.93,54.61 20.93,57.86 IC1.2 | IC3.2 v23.5,49.53
  Bottom 0.152: v20.93,54.61 20.96,54.61 23.5,52.07 v23.5,49.53
N$14
  Top 0.152: IC3.1 22.23,50.23 22.84,50.84 22.84,55.64 22.23,56.25 IC1.3
N$15
  Top 0.152: IC5.4 19.58,9.31 19.05,9.84 IC7.2
N$16
  Top 0.152: IC11.13 53.98,36.09 54.63,35.44 54.63,30.83 55.86,29.61 55.86,25.44 55.24,24.82 IC9.3
N$17
  Top 0.152: U3.13 59.73,50.53 61.26,52.07 66.04,52.07 67.95,53.98
  Top 0.254: 67.95,53.98 R7.1
N$19
  Top 0.152: IC4.4 12.06,48.26 10.16,50.16 10.16,59.05 6.98,62.23 IC2.15
N$20
  Top 0.152: U1.13 47.03,54.36 R10.1
N$21
  Top 0.152: IC1.4 IC3.15
N$22
  Top 0.152: IC1.5 IC3.14
N$23
  Top 0.152: IC1.6 IC3.13
N$24
  Top 0.152: IC3.12 IC1.7
N$25  (via drill 0.35)
  Top 0.152: v5.71,55.88 IC2.1 | v10.79,47.62 IC4.3
  Bottom 0.152: v5.71,55.88 6.98,55.88 10.79,52.07 v10.79,47.62
N$26
  Top 0.152: R6.1 60.64,53.34 58.42,51.12 U3.15
  Top 0.254: U3.15
N$27  (via drill 0.35)
  Top 0.152: v6.96,54.61 6.96,57.86 IC2.2 | v9.53,48.26 IC4.2
  Bottom 0.152: v6.96,54.61 9.53,52.05 v9.53,48.26
N$28
  Top 0.152: IC4.1 8.26,50.23 8.87,50.84 8.87,55.64 8.26,56.25 IC2.3
N$29
  Top 0.152: IC4.15 IC2.4
N$30
  Top 0.152: IC4.14 IC2.5
N$31
  Top 0.152: IC4.13 IC2.6
N$32
  Top 0.152: IC4.12 IC2.7
N$34
  Top 0.152: 57.15,54.08 57.15,49.51
  Top 0.254: R5.1 57.15,54.08 | 57.15,49.51 U3.17
N$35
  Top 0.406: LED1.A 14.19,69.64 R2.2
N$36
  Top 0.406: R3.2 8.47,71.55 LED2.A
N$37
  Top 0.152: R9.1 44.45,53.76 45.73,52.48 U1.15
N$39
  Top 0.152: R4.1 41.91,53.76 44.43,51.24 U1.17
N$44  (via drill 0.35)
  Top 0.152: IC1.9 v28.58,62.23 | v8.26,62.23 IC2.14
  Bottom 0.152: v28.58,62.23 26.36,62.23 26.31,62.28 11.79,62.28 11.74,62.23 v8.26,62.23
O1
  Top 0.152: R4.2 41.91,56.3 40.42,57.79 40.42,67.73 40.96,68.26 42.54,68.26 43.81,69.53 43.81,72.06 J2.2
O2
  Top 0.152: R9.2 44.45,60 J3.2
O3
  Top 0.152: J4.2
  Top 0.203: R10.2 46.67,56.41 46.67,62.23 51.75,67.31 J4.2
O4
  Top 0.152: J5.2
  Top 0.203: R11.2 J5.2
O5
  Top 0.203: J6.2 63.17,67.3 57.78,61.91 57.78,56.41 R5.2
O6
  Top 0.203: R6.2 60.64,58.11 J7.2
O7
  Top 0.203: R7.2 68.53,56.68 68.53,69.81 J8.2
O8
  Top 0.203: R8.2 71.12,60.97 J9.2
Q
  Top 0.203: IC7.9 26.67,23.27 IC16.1
QA
  Top 0.152: IC8.15 49.53,12.06 54.29,16.83 56.2,16.83 59.69,20.32 59.69,25.08 59.05,25.72 IC9.9
QB
  Top 0.152: IC9.5 57.78,20.64 54.93,17.78 50.8,17.78 IC8.1
QC
  Top 0.152: IC9.12 55.24,25.65 54.61,25.01 54.61,20.32 53.02,18.73 50.16,18.73 49.53,18.1 IC8.2
QD
  Top 0.152: IC9.2 53.98,20.64 53.02,19.68 49.53,19.68 48.26,18.41 IC8.3
QE
  Top 0.152: IC8.4 46.99,24.77 46.35,25.4 IC10.9
QF
  Top 0.152: IC8.5 45.72,19.05 45.09,19.68 IC10.5
QG
  Top 0.152: IC10.12 42.54,25.65 41.93,25.04 41.93,20.56 44.45,18.04 IC8.6
QH
  Top 0.152: IC10.2 41.27,20 43.18,18.1 IC8.7
RCK
  Top 0.254: IC7.6 24.13,12.7 29.21,7.62 43.5,7.62 45.72,9.84 IC8.12
SCL
  Bottom 0.203: JP1.5 21.59,34.29 20.96,34.92 8.26,34.92 X2.2
SDA
  Bottom 0.152: JP1.3 X2.1
SPI_CLK  (via drill 0.35)
  Top 0.152: IC14.2 19.05,33.93 19.69,34.57 19.69,38.73 16.49,41.93 16.49,46.95 15.24,48.2 15.24,48.26 12.68,50.82 12.68,61.01 v12.06,61.62 IC2.11 | IC1.11 v26.04,61.62
  Top 0.254: IC8.11 44.45,12.06 43.81,12.7 32.38,12.7 JP1.23 26.35,16.19 21.27,16.19 | 21.27,16.19 18.42,16.19 17.78,15.56 IC7.1 | 21.27,16.19 21.27,18.1 21.59,18.41 IC7.13 21.59,28.26 19.05,30.8 IC14.2
  Bottom 0.152: v26.04,61.62 v12.06,61.62
SPI_CS0
  Top 0.152: IC7.14 20.32,21.59 18.73,23.18 18.73,24.13 18.08,24.78 IC6.4 17.78,24.88 IC14.1
SPI_MOSI
  Top 0.152: JP1.19 30.8,16.51 28.58,18.73 28.58,40.34 30.23,41.99 30.23,44.33 30.46,44.56 30.46,46.97 31.73,48.24 31.73,53.1 31.72,53.11 31.72,57.12 28.54,60.3 24.49,60.3 22.25,62.54 22.25,64.01 IC1.14
  Top 0.254: IC8.14 48.26,12.06 45.09,15.24 32.38,15.24 JP1.19
T0H  (via drill 0.35)
  Top 0.152: v41.27,26.04 | IC9.13 v53.98,26.04 v53.97,26.04 | v27.31,43.81 IC3.5
  Top 0.254: IC9.4 v56.52,23.5 56.52,24.77 57.78,26.04 IC9.10 | v52.7,23.5 IC9.1 | IC10.1 v40,23.5 | IC10.4 v43.81,23.5 43.81,24.77 45.09,26.04 IC10.10 | IC10.13 v41.27,26.04 | v35.56,42.86 v35.56,39.39
  Bottom 0.152: v41.27,26.04 v41.27,26.03 | v53.97,26.04 v53.98,26.03 | v35.56,42.86 28.26,42.86 v27.31,43.81
  Bottom 0.254: v56.52,23.5 53.98,23.5 | 53.98,23.5 v52.7,23.5 v43.81,23.5 41.27,23.5 | v40,23.5 41.27,23.5 | v41.27,26.03 41.27,23.5 | v53.98,26.03 53.98,23.5 | v35.56,39.39 35.56,31.7 41.22,26.04 v41.27,26.04
T1H  (via drill 0.35)
  Top 0.152: IC12.10 45.09,35.56 v43.81,34.29 IC12.4
  Top 0.203: v13.33,44.13 IC4.5
  Top 0.254: IC11.10 57.78,36.83 56.52,35.56 v56.52,34.29 IC11.4 | IC11.1 v52.7,34.29 | v40,34.29 IC12.1 | IC11.12 v55.24,36.83 | v42.54,41.59 IC12.12 42.54,36.83 v42.59,36.83
  Bottom 0.152: v42.54,41.59 42.25,41.89 15.58,41.89 v13.33,44.13
  Bottom 0.254: 42.59,34.29 v43.81,34.29 v52.7,34.29 55.24,34.29 | v56.52,34.29 55.24,34.29 | v55.24,36.83 55.24,34.29 | v42.59,36.83 42.59,34.29 | v40,34.29 42.59,34.29
VCC  (via drill 0.35)
  Top 0.152: IC14.10 IC14.7 | 20.97,6.37 20.96,6.35 | C1.1 16.19,19.58
  Top 0.203: 18.1,19.58 IC7.16
  Top 0.305: IC7.4 21.59,9.93 IC5.5
  Top 0.406: 17.46,37.15 IC14.16 v17.78,38.71 | 4.03,64.03 C2.1 | IC14.10 v25.4,38.71 | 17.78,23.38 v17.78,21.27 IC7.16 | IC7.10 v25.4,21.27 25.19,21.49 IC16.5 | IC15.5 20.95,70.48 C13.1 20.64,68.05 C14.1 20.64,67.84 | R3.1 8.26,66.04
  Top 0.508: IC14.9 IC14.10 | C6.1 52.49,10.9 | C7.1 38.1,38.63 | X2.3 14.29,31.75 | C4.1 6.57,51.97 6.47,52.07 | IC3.16 20.54,51.97 C5.1 20.32,52.28 16.51,56.2 16.51,59.69 13.33,62.87 IC2.10 | C11.1 15.88,37.15 | 49.63,38.63 49.53,38.73
  Top 0.61: IC1.10 27.31,65.41 26.67,66.04 20.64,66.04 | 52.49,10.9 IC8.16 50.8,9.53 47.62,6.35 v43.18,6.35 20.96,6.35 20.64,6.35 14.29,12.7 14.29,19.37 | 13.33,66.04 8.26,66.04 6.35,66.04 5.71,65.41 IC2.16 4.03,64.03 3.02,64.03 2.17,63.18 2.17,53.71 3.81,52.07 | 13.33,66.04 17.78,66.04 | 17.78,66.04 20.64,66.04 | IC2.10 13.33,66.04 | v40,40.32 IC12.14 38.1,38.63 37.36,38.63 36.83,38.1 36.83,27.62 | 14.29,37.15 15.88,37.15 17.46,37.15 | IC1.16 18,64.03 C3.1 17.78,66.04 | IC4.16 6.57,51.97 | 14.29,37.15 14.29,31.75 14.29,19.37 | IC9.14 50.8,27.84 | C10.1 50.8,27.84 | v48.89,40.64 49.53,40.01 49.53,38.73 49.53,28.57 50.27,27.84 50.8,27.84 | IC11.14 50.8,38.63 | 50.8,38.63 49.63,38.63 | C8.1 50.8,38.63 | 3.81,52.07 3.81,47.62 14.29,37.15 | 3.81,52.07 6.47,52.07 | IC7.15 18.1,19.58 16.19,19.58 15.98,19.37 14.29,19.37 | IC5.5 20.97,6.37 | IC6.5 17.78,23.38 | 20.64,67.84 20.64,66.04 | IC10.14 38.1,27.84 | 38.1,27.84 37.05,27.84 36.83,27.62 | C9.1 38.1,27.84 | v38.42,16.83 36.83,18.41 36.83,27.62 | IC8.10 v43.18,9.21
  Bottom 0.406: v17.78,38.71 v25.4,38.71 | v25.4,21.27 v17.78,21.27
  Bottom 0.61: v48.89,40.64 40.32,40.64 v40,40.32 | v43.18,6.35 v43.18,9.21 43.18,12.06 v38.42,16.83

### Text on the board
tNames: GND | DATA | Out 6 | Out 4 | CLK | Out 8 | Out 2 | Out 7 | Out 1 | Out 5 | Out 3 | SDA | SCL | VCC | GND | GND | + | WS2811 / WS2812 / WS2812B / WS2813 / WS2815 / SK6812 / SK6812W / UCS1903 / UCS2903 / CS8812 / / WS2801 / APA102 / SK9822 | sACN E1.31 | Art-Net 4 | 8x 4 Universes | www.orangepi-dmx.org